# EAGLE design pcb_bare_tmc_2209 (EAGLE 9.6.2)

## Sheet 1 of 4: ESP32
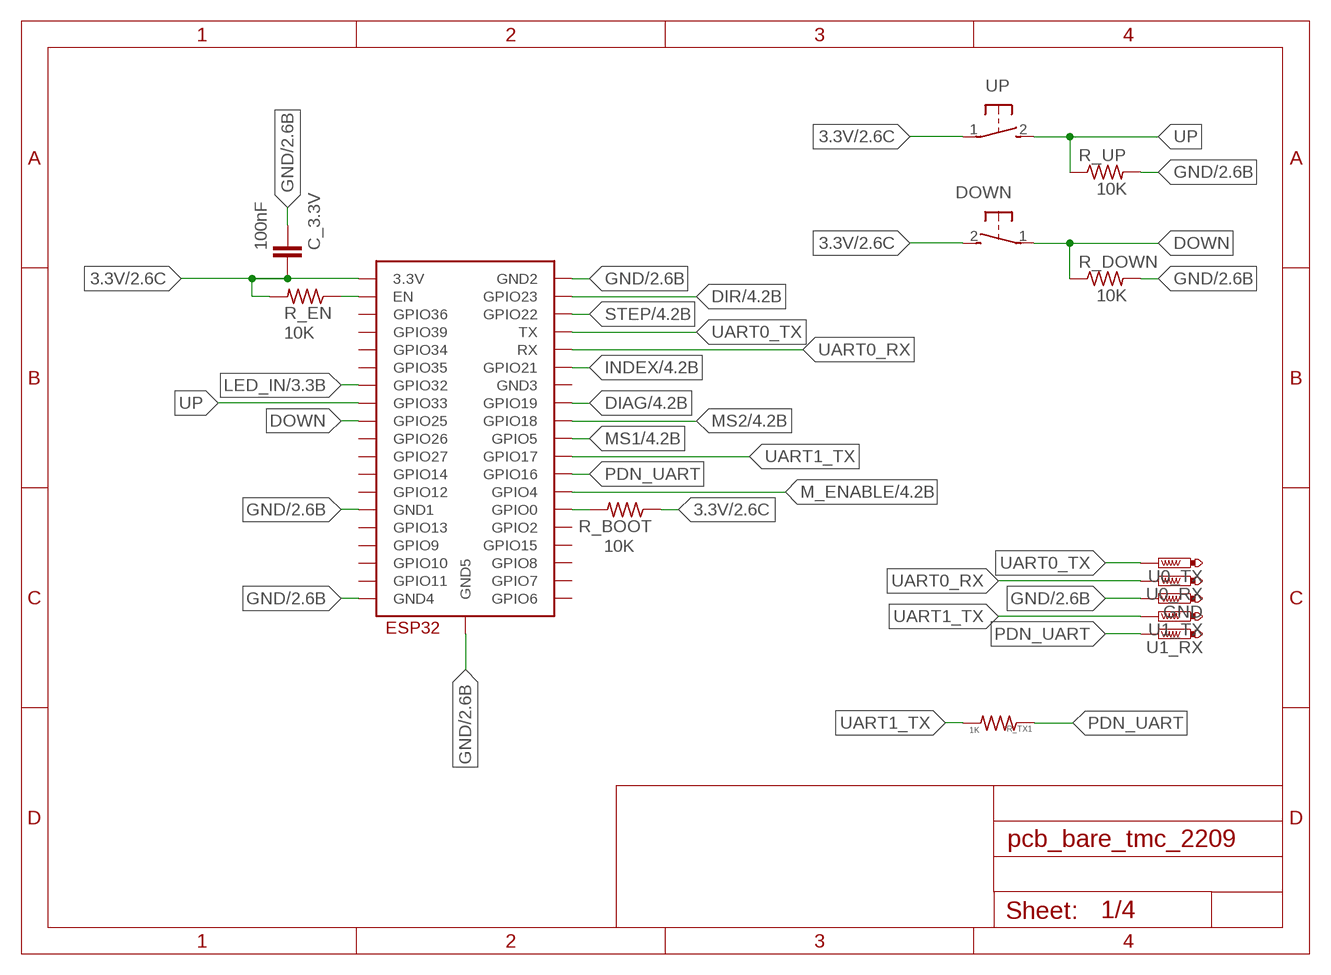
[diagram p0: schematic, sheet 1]

### Parts
C_3.3V  100nF  C-EUC0805K  [C0805K]
DOWN  31-XX  [B3F-31XX]
GND  PTR1TP20SQ  [TP20SQ]
R_BOOT  10K  R-US_R0805  [R0805]
R_DOWN  10K  R-US_R0805  [R0805]
R_EN  10K  R-US_R0805  [R0805]
R_TX1  1K  R-US_R0805  [R0805]
R_UP  10K  R-US_R0805  [R0805]
U0_RX  PTR1TP20SQ  [TP20SQ]
U0_TX  PTR1TP20SQ  [TP20SQ]
U1_RX  PTR1TP20SQ  [TP20SQ]
U1_TX  PTR1TP20SQ  [TP20SQ]
U$2  ESP32-WROOM  [ESP32-WROOM]
UP  31-XX  [B3F-31XX]

### Nets
3.3V: C_3.3V.2 DOWN.2(S) R_BOOT.1 R_EN.2 U$2.3V3(3.3V) UP.1(P) ; also sheet 2
DIAG: U$2.IO19(GPIO19) ; also sheet 4
DIR: U$2.IO23(GPIO23) ; also sheet 4
DOWN: DOWN.1(P) R_DOWN.1 U$2.IO25(GPIO25)
GND: C_3.3V.1 GND.TP R_DOWN.2 R_UP.2 U$2.GND1 U$2.GND2 U$2.GND4 U$2.GND5 ; also sheet 2,3,4
INDEX: U$2.IO21(GPIO21) ; also sheet 4
LED_IN: U$2.IO32(GPIO32) ; also sheet 3
M_ENABLE: U$2.IO4(GPIO4) ; also sheet 4
MS1: U$2.IO5(GPIO5) ; also sheet 4
MS2: U$2.IO18(GPIO18) ; also sheet 4
N$3: R_BOOT.2 U$2.IO0(GPIO0)
N$10: R_EN.1 U$2.EN
PDN_UART: R_TX1.1 U1_RX.TP U$2.IO16(GPIO16) ; also sheet 4
STEP: U$2.IO22(GPIO22) ; also sheet 4
UART0_RX: U0_RX.TP U$2.RX
UART0_TX: U0_TX.TP U$2.TX
UART1_TX: R_TX1.2 U1_TX.TP U$2.IO17(GPIO17)
UP: R_UP.1 U$2.IO33(GPIO33) UP.2(S)
Unconnected: U$2.CLK(GPIO6) U$2.CMD(GPIO11) U$2.GND3 U$2.IO2(GPIO2) U$2.IO12(GPIO12) U$2.IO13(GPIO13) U$2.IO14(GPIO14) U$2.IO15(GPIO15) U$2.IO26(GPIO26) U$2.IO27(GPIO27) U$2.IO34(GPIO34) U$2.IO35(GPIO35) U$2.SD0(GPIO7) U$2.SD1(GPIO8) U$2.SD2(GPIO9) U$2.SD3(GPIO10) U$2.SENSOR_VN(GPIO39) U$2.SENSOR_VP(GPIO36)

## Sheet 2 of 4: Power Supply
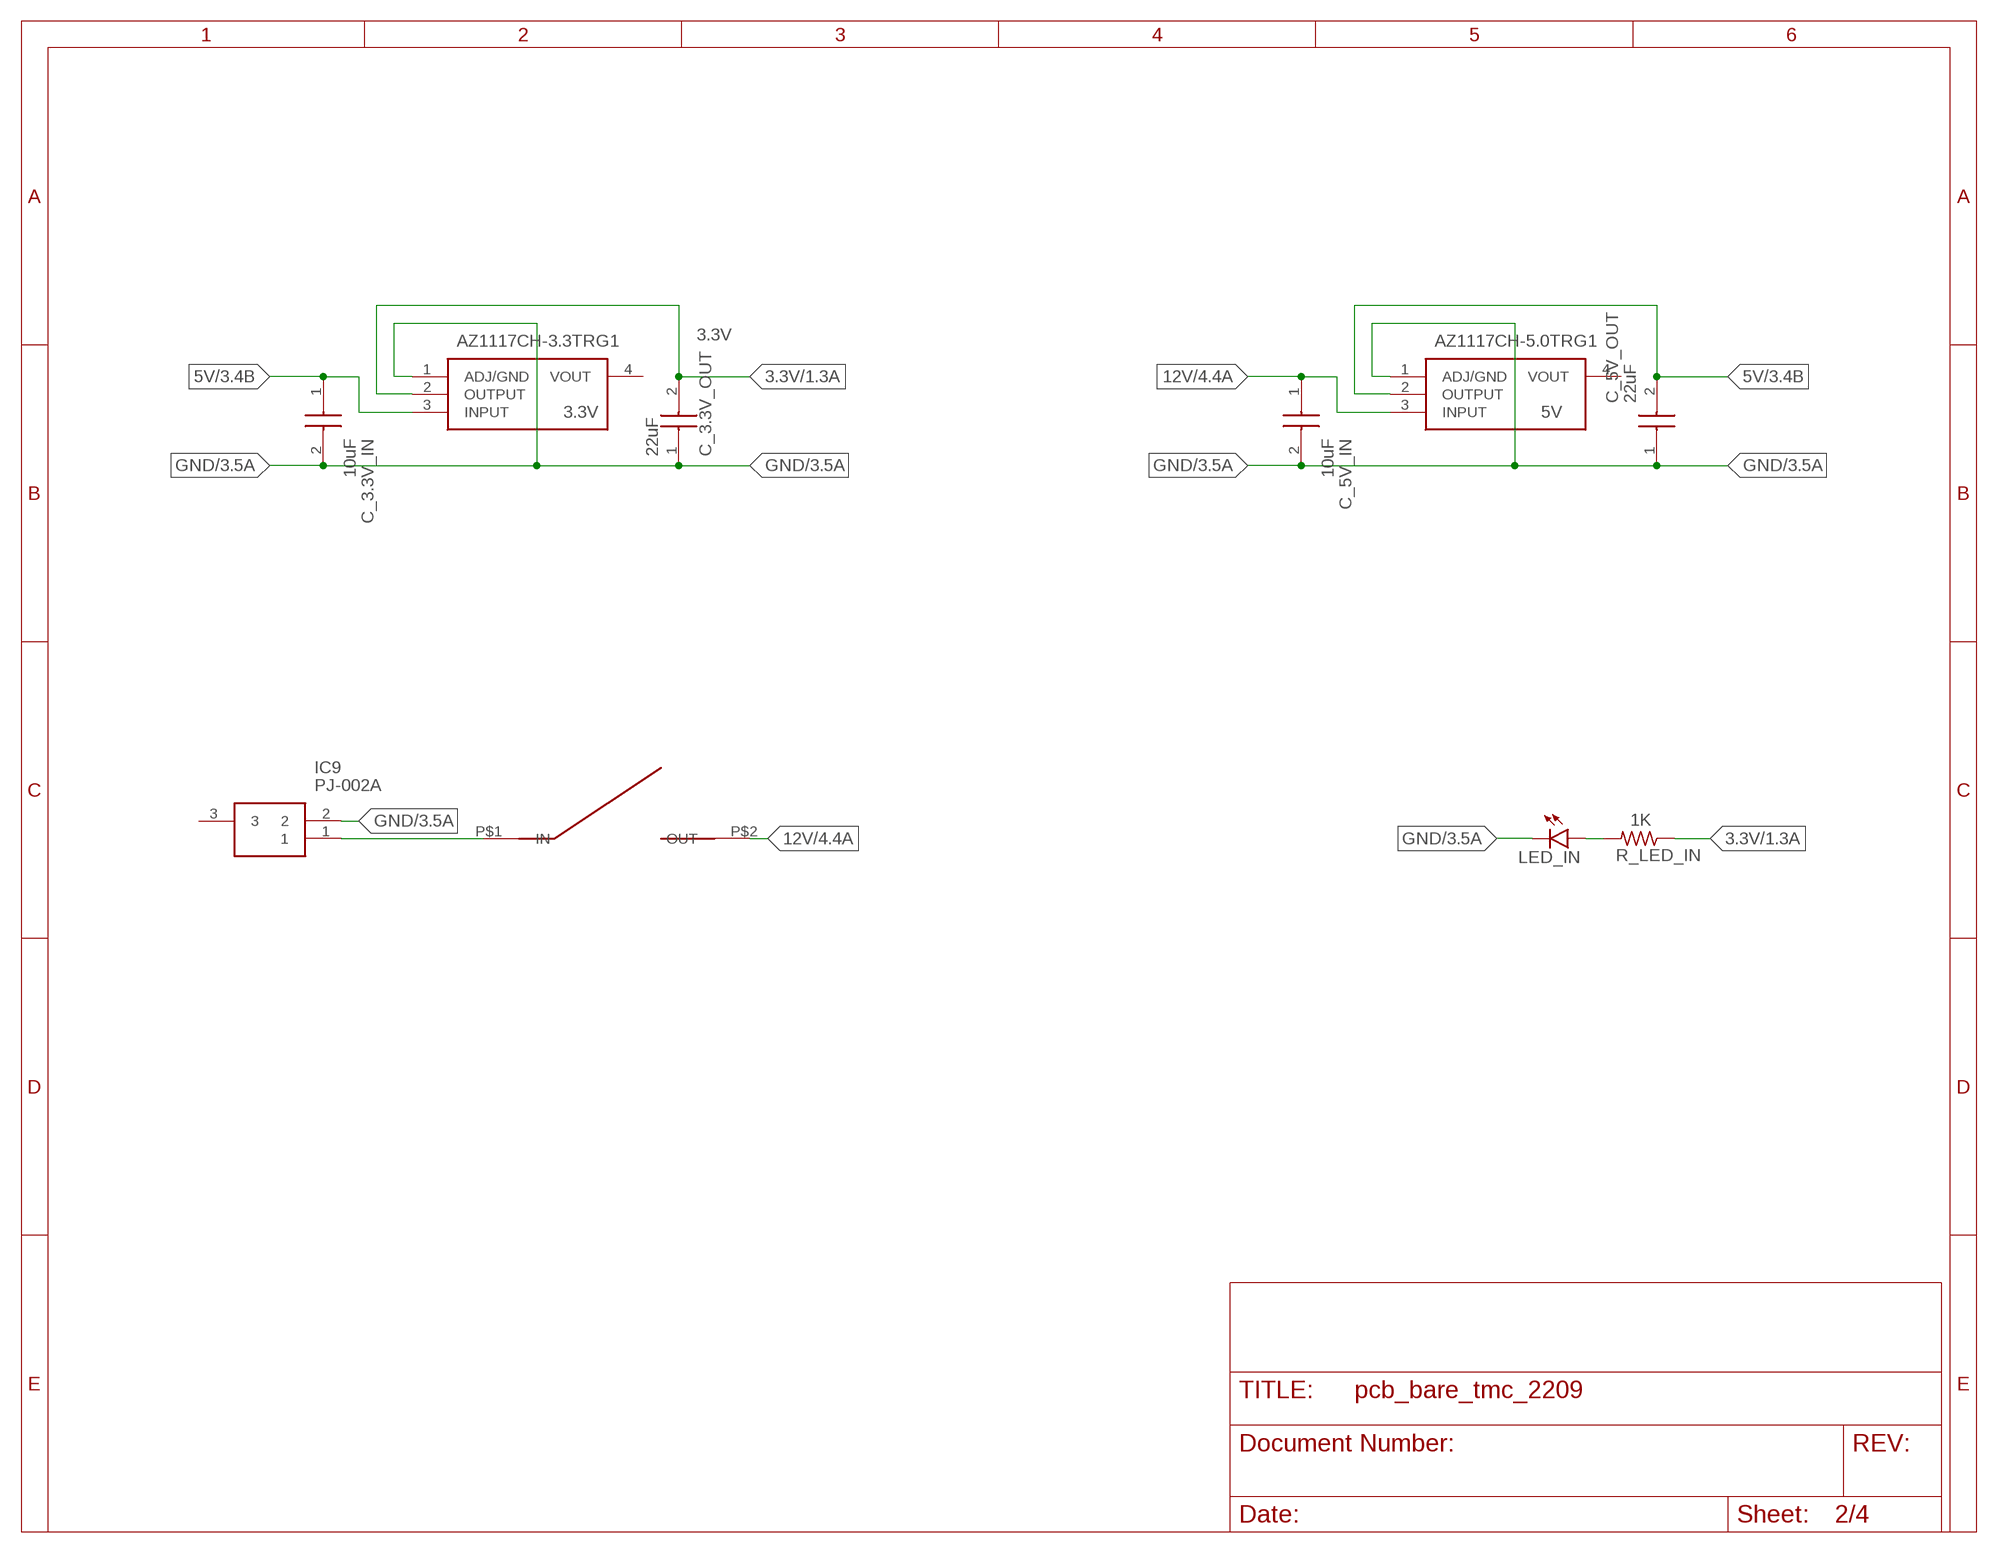
[diagram p1: schematic, sheet 2]

### Parts
3.3V  AZ1117CH-3.3TRG1  [SOT230P700X180-4N]
5V  AZ1117CH-5.0TRG1  [SOT230P700X180-4N]
C_3.3V_IN  10uF  EMK212ABJ106KD-T  [CAPC2013X95N]
C_3.3V_OUT  22uF  CL31A226MOCLNNC  [CAPC3216X100N]
C_5V_IN  10uF  EMK212ABJ106KD-T  [CAPC2013X95N]
C_5V_OUT  22uF  CL31A226MOCLNNC  [CAPC3216X100N]
IC9  PJ-002A  [PJ002A]
LED_IN  LEDSML0805  [SML0805]
R_LED_IN  1K  R-US_R0805  [R0805]
U$1  SPSTROCKERSWITCH2PIN  [SPST2PINROCKER]

### Nets
3.3V: 3.3V.2(OUTPUT) C_3.3V_OUT.2 R_LED_IN.1 ; also sheet 1
5V: 3.3V.3(INPUT) 5V.2(OUTPUT) C_3.3V_IN.1 C_5V_OUT.2 ; also sheet 3,4
12V: 5V.3(INPUT) C_5V_IN.1 U$1.P$2(OUT) ; also sheet 4
GND: 3.3V.1(ADJ/GND) 5V.1(ADJ/GND) C_3.3V_IN.2 C_3.3V_OUT.1 C_5V_IN.2 C_5V_OUT.1 IC9.2 LED_IN.C ; also sheet 1,3,4
N$1: IC9.1 U$1.P$1(IN)
N$2: LED_IN.A R_LED_IN.2
Unconnected: 3.3V.4(VOUT) 5V.4(VOUT) IC9.3

## Sheet 3 of 4: LED/LEVELSHIFTER
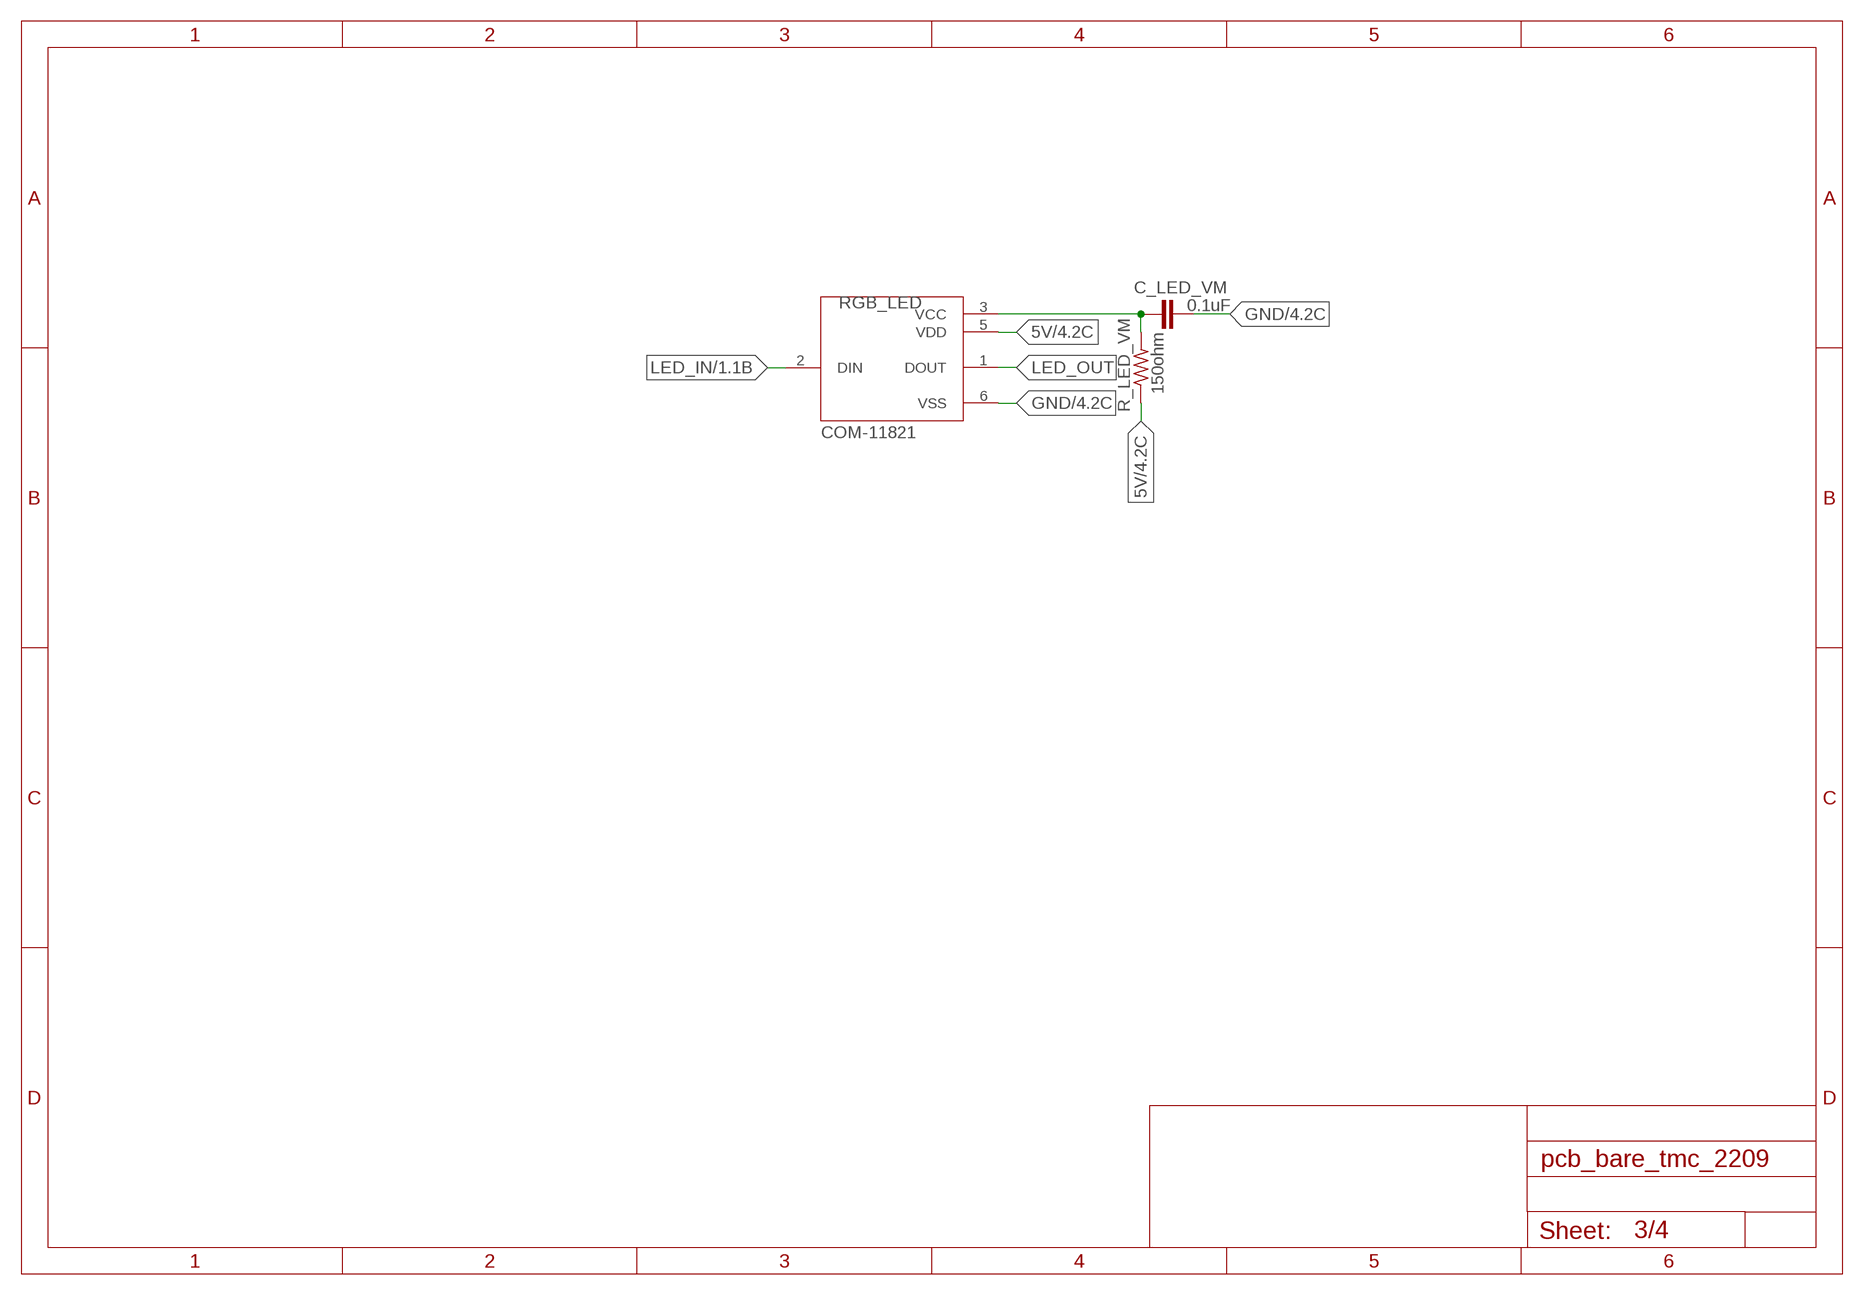
[diagram p2: schematic, sheet 3]

### Parts
C_LED_VM  0.1uF  C-EUC0805K  [C0805K]
R_LED_VM  150ohm  R-US_R0805  [R0805]
RGB_LED  COM-11821  [LED_COM-11821]

### Nets
5V: R_LED_VM.1 RGB_LED.5(VDD) ; also sheet 2,4
GND: C_LED_VM.2 RGB_LED.6(VSS) ; also sheet 1,2,4
LED_IN: RGB_LED.2(DIN) ; also sheet 1
LED_OUT: RGB_LED.1(DOUT)
N$77: C_LED_VM.1 R_LED_VM.2 RGB_LED.3(VCC)

## Sheet 4 of 4
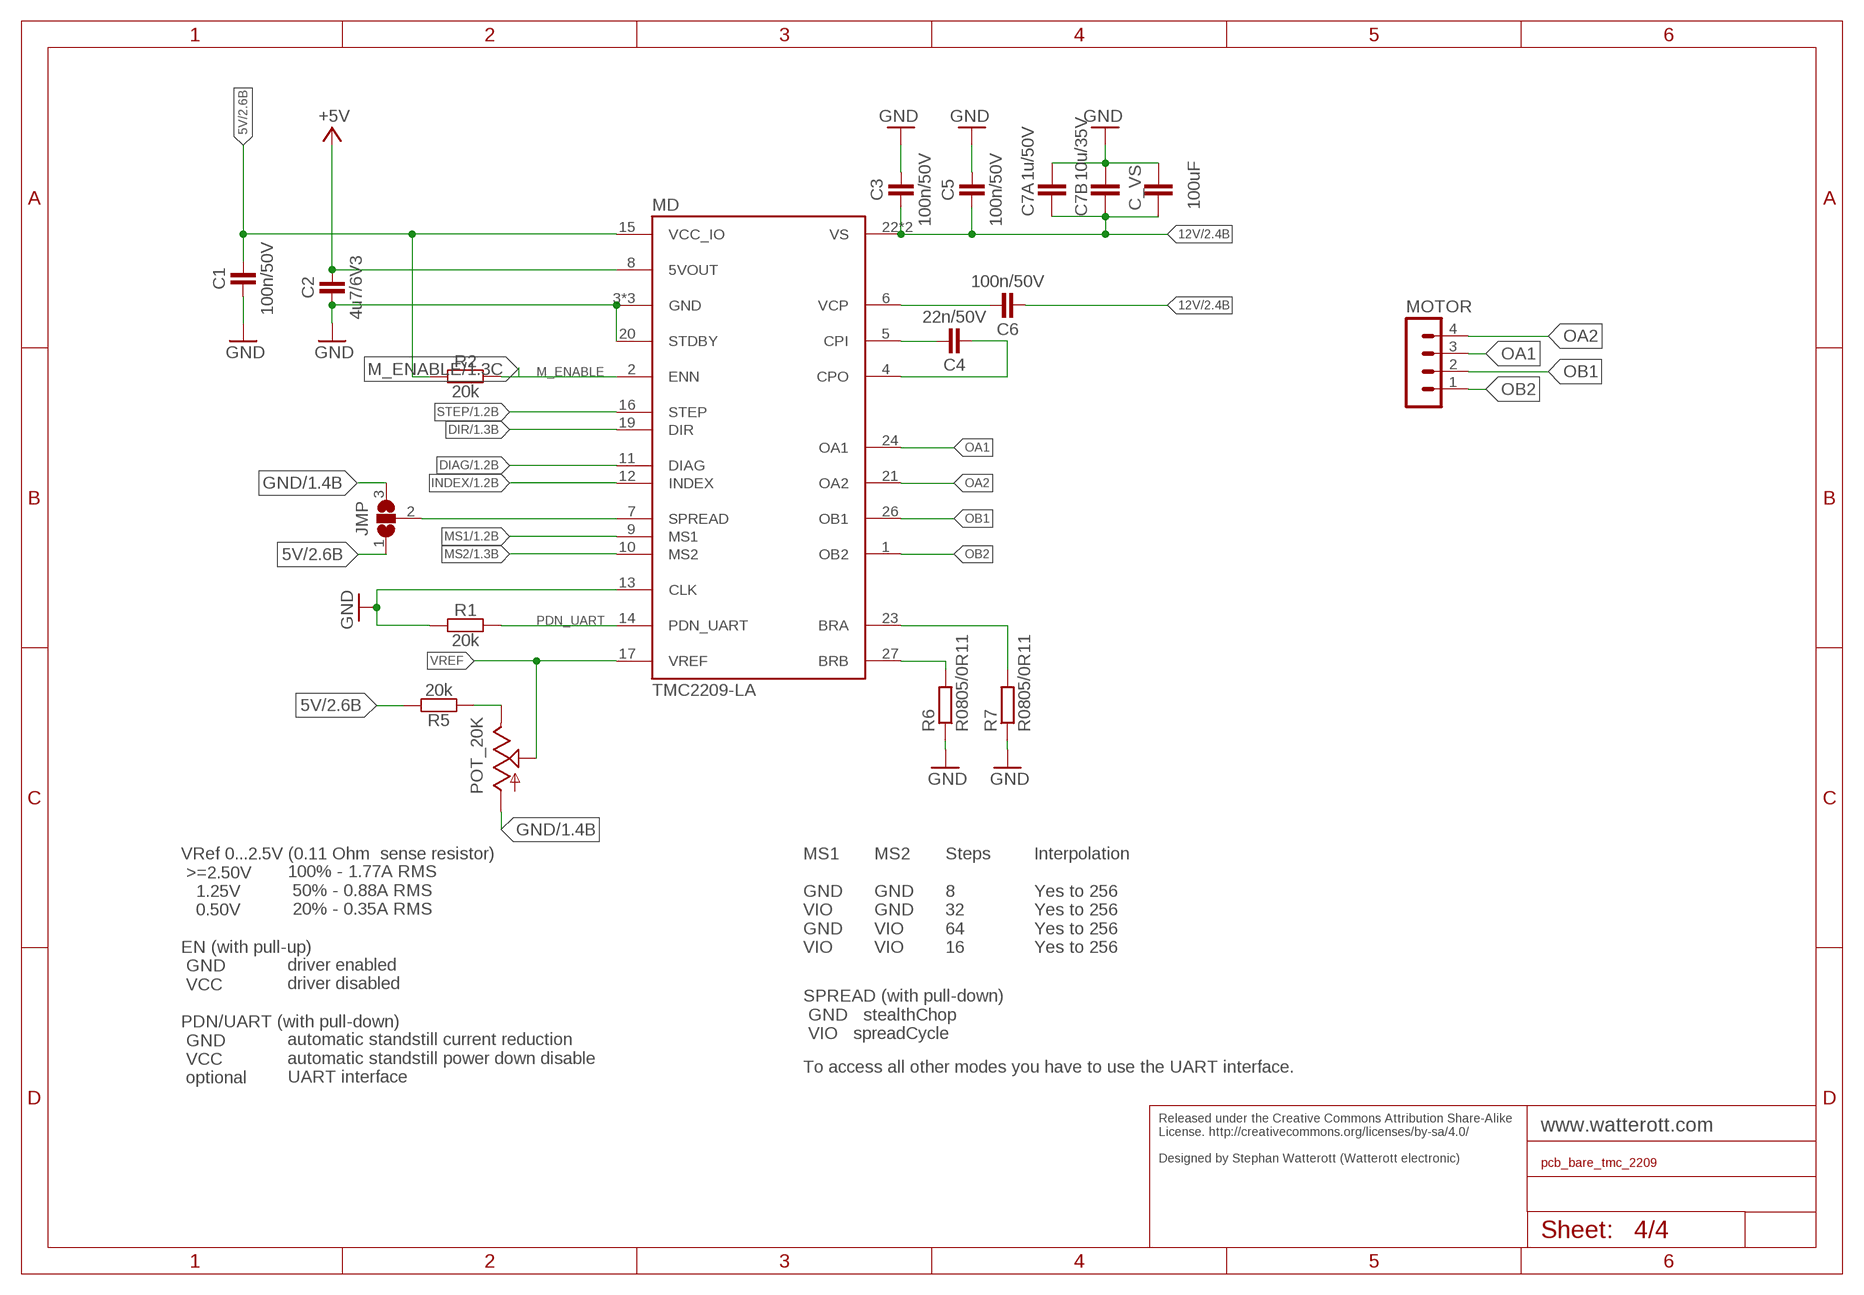
[diagram p3: schematic, sheet 4]

### Parts
C1  100n/50V  CAPACITOR-0402  [C0402]
C2  4u7/6V3  CAPACITOR-0402  [C0402]
C3  100n/50V  CAPACITOR-0402  [C0402]
C4  22n/50V  CAPACITOR-0402  [C0402]
C5  100n/50V  CAPACITOR-0402  [C0402]
C6  100n/50V  CAPACITOR-0402  [C0402]
C7A  1u/50V  C-EUC0805  [C0805]
C7B  10u/35V  C-EUC1206  [C1206]
C_VS  100uF  C2,5-3  [C2.5-3]
JMP  JUMPER3-0402-NC  [JUMPER3-0402_NC]
MD  TMC2209-LA  [QFN28-PAD3.7]
MOTOR  MA04-1  [MA04-1]
POT_20K  TRIM_US-3223G  [3223G]
R1  20k  RESISTOR-0402  [C0402]
R2  20k  RESISTOR-0402  [C0402]
R5  20k  RESISTOR-0402  [C0402]
R6  R0805/0R11  R-EU_M0805  [M0805]
R7  R0805/0R11  R-EU_M0805  [M0805]

### Nets
5V: C1.2 JMP.1 MD.15(VCC_IO) R2.1 R5.2 ; also sheet 2,3
12V: C3.1 C5.1 C6.1 C7A.1 C7B.1 C_VS.1 MD.22(VS) MD.28(VS) ; also sheet 2
+5V: C2.2 MD.8(5VOUT)
BRA: MD.23(BRA) R7.2
BRB: MD.27(BRB) R6.2
CPI: C4.2 MD.5(CPI)
CPO: C4.1 MD.4(CPO)
DIAG: MD.11(DIAG) ; also sheet 1
DIR: MD.19(DIR) ; also sheet 1
GND: C1.1 C2.1 C3.2 C5.2 C7A.2 C7B.2 C_VS.2 JMP.3 MD.3(GND) MD.13(CLK) MD.18(GND) MD.20(STDBY) MD.TP(GND) POT_20K.1(A) R1.1 R6.1 R7.1 ; also sheet 1,2,3
INDEX: MD.12(INDEX) ; also sheet 1
M_ENABLE: MD.2(ENN) R2.2 ; also sheet 1
MS1: MD.9(MS1) ; also sheet 1
MS2: MD.10(MS2) ; also sheet 1
N$4: JMP.2 MD.7(SPREAD)
OA1: MD.24(OA1) MOTOR.3
OA2: MD.21(OA2) MOTOR.4
OB1: MD.26(OB1) MOTOR.2
OB2: MD.1(OB2) MOTOR.1
PDN_UART: MD.14(PDN_UART) R1.2 ; also sheet 1
STEP: MD.16(STEP) ; also sheet 1
VCP: C6.2 MD.6(VCP)
VREF: MD.17(VREF) POT_20K.2(S)
VREF1: POT_20K.3(E) R5.1

### Notes on the sheet
- VRef 0...2.5V (0.11 Ohm  sense resistor)
   >=2.50V
     1.25V
     0.50V
  
  EN (with pull-up)
   GND
   VCC
  
  PDN/UART (with pull-down)
   GND
   VCC
   optional
- MS1
  
  GND
  VIO
  GND
  VIO
- MS2
  
  GND
  GND
  VIO
  VIO
- Steps
  
  8
  32
  64
  16
- Interpolation
  
  Yes to 256
  Yes to 256
  Yes to 256
  Yes to 256
- 100% - 1.77A RMS
   50% - 0.88A RMS
   20% - 0.35A RMS
  
  
  driver enabled
  driver disabled
  
  
  automatic standstill current reduction
  automatic standstill power down disable
  UART interface
- SPREAD (with pull-down)
   GND   stealthChop
   VIO   spreadCycle
- To access all other modes you have to use the UART interface.
- Released under the Creative Commons Attribution Share-Alike 
  License. http://creativecommons.org/licenses/by-sa/4.0/
  
  Designed by Stephan Watterott (Watterott electronic)

## Library data of the parts
3.3V = SamacSys_Parts:AZ1117CH-3.3TRG1: 1.35A 3.3V LDO Reg. Current Limit SOT223 DiodesZetex AZ1117CH-3.3TRG1, LDO Voltage Regulator, 0.8A, 3.3 V +/-1%, maximum of 15 Vin, 3-Pin SOT-223 Source: Datasheet <https://datasheet.datasheetarchive.com/originals/distributors/Datasheets-DGA25/1776204.pdf>; DESCRIPTION: 1.35A 3.3V LDO Reg. Current Limit SOT223 DiodesZetex AZ1117CH-3.3TRG1, LDO Voltage Regulator, 0.8A, 3.3 V +/-1%, maximum of 15 Vin, 3-Pin SOT-223; HEIGHT: 1.8mm; MANUFACTURER_NAME: Diodes Inc.; MANUFACTURER_PART_NUMBER: AZ1117CH-3.3TRG1; MOUSER_PART_NUMBER: 621-AZ1117CH-3.3TRG1; MOUSER_PRICE-STOCK: https://www.mouser.co.uk/ProductDetail/Diodes-Incorporated/AZ1117CH-33TRG1?qs=FKu9oBikfSm7ntaG6olPSQ%3D%3D
5V = SamacSys_Parts:AZ1117CH-5.0TRG1: DiodesZetex AZ1117CH-5.0TRG1, LDO Regulator, 300mA, 5 V, +/-1% 3+Tab-Pin, SOT-223 Source: Datasheet <https://www.diodes.com/assets/Datasheets/AZ1117C.pdf>; DESCRIPTION: DiodesZetex AZ1117CH-5.0TRG1, LDO Regulator, 300mA, 5 V, +/-1% 3+Tab-Pin, SOT-223; HEIGHT: 1.8mm; MANUFACTURER_NAME: Diodes Inc.; MANUFACTURER_PART_NUMBER: AZ1117CH-5.0TRG1; MOUSER_PART_NUMBER: 621-AZ1117CH-5.0TRG1; MOUSER_PRICE-STOCK: https://www.mouser.co.uk/ProductDetail/Diodes-Incorporated/AZ1117CH-50TRG1?qs=FKu9oBikfSlJYUAtiuMgOw%3D%3D
C1-C6 = we-rcl:CAPACITOR: Capacitor ...2.2uF @ 6.3V -> 0402 ...4.7uF @ 6.3V -> 0603 ...10uF @ 16V -> 0805 ...22uF @ 25V -> 1206
C7A C7B = rcl:C-EU: CAPACITOR, European symbol
C_3.3V C_LED_VM = rcl:C-EU: CAPACITOR, European symbol; SPICEPREFIX: C
C_3.3V_IN C_5V_IN = SamacSys_Parts:EMK212ABJ106KD-T: Taiyo Yuden 0805 (2012M) 10uF Multilayer Ceramic Capacitor MLCC 16V dc +/-10% SMD EMK212ABJ106KD-T Source: Datasheet <https://ds.yuden.co.jp/TYCOMPAS/ut/detail?pn=EMK212ABJ106KD-T &u=M>; DESCRIPTION: Taiyo Yuden 0805 (2012M) 10uF Multilayer Ceramic Capacitor MLCC 16V dc +/-10% SMD EMK212ABJ106KD-T; HEIGHT: 0.95mm; MANUFACTURER_NAME: TAIYO YUDEN; MANUFACTURER_PART_NUMBER: EMK212ABJ106KD-T; MOUSER_PART_NUMBER: 963-EMK212ABJ106KD-T; MOUSER_PRICE-STOCK: https://www.mouser.co.uk/ProductDetail/Taiyo-Yuden/EMK212ABJ106KD-T?qs=I6KAKw0tg2yYKujEsK8opA%3D%3D
C_3.3V_OUT C_5V_OUT = SamacSys_Parts:CL31A226MOCLNNC: Ceramic capacitor 1206 X5R 16V 22uF Samsung Electro-Mechanics 1206 CL 22uF Ceramic Multilayer Capacitor, 16 V, +85C, X5R Dielectric, +/-20% SMD Source: Datasheet <https://datasheet.datasheetarchive.com/originals/distributors/Datasheets_SAMA/f725fe7da06092c10c109ee50d712988.pdf>; DESCRIPTION: Ceramic capacitor 1206 X5R 16V 22uF Samsung Electro-Mechanics 1206 CL 22uF Ceramic Multilayer Capacitor, 16 V, +85C, X5R Dielectric, +/-20% SMD; HEIGHT: 1mm; MANUFACTURER_NAME: Samsung Electro-Mechanics; MANUFACTURER_PART_NUMBER: CL31A226MOCLNNC; MOUSER_PART_NUMBER: 187-CL31A226MOCLNNC; MOUSER_PRICE-STOCK: https://www.mouser.co.uk/ProductDetail/Samsung-Electro-Mechanics/CL31A226MOCLNNC?qs=X6jEic%2FHinD7wddQJyY%252BZw%3D%3D
C_VS = capacitor-wima:C: CAPACITOR naming: grid - package width
DOWN UP = switch-omron:31-XX: OMRON SWITCH; MPN: B3F-3100; OC_FARNELL: 959704; OC_NEWARK: 36M3582
GND U0_RX U0_TX U1_RX U1_TX = testpad:PTR1: TEST PIN
IC9 = SamacSys_Parts:PJ-002A: CONN PWR JACK 2X5.5MM SOLDER Source: Datasheet <https://www.cui.com/product/resource/digikeypdf/pj-002a.pdf>; DESCRIPTION: CONN PWR JACK 2X5.5MM SOLDER; HEIGHT: 11mm; MANUFACTURER_NAME: CUI Inc.; MANUFACTURER_PART_NUMBER: PJ-002A; MOUSER_PART_NUMBER: 490-PJ-002A; MOUSER_PRICE-STOCK: https://www.mouser.co.uk/ProductDetail/CUI-Devices/PJ-002A?qs=WyjlAZoYn51CKfAix9Mngw%3D%3D
JMP = we-rcl:JUMPER3: 3-Pin Jumper
LED_IN = led:LED: LED OSRAM: - CHIPLED LG R971, LG N971, LY N971, LG Q971, LY Q971, LO R971, LY R971 LH N974, LH R974 LS Q976, LO Q976, LY Q976 LO Q996 - Hyper CHIPLED LW Q18S LB Q993, LB Q99A, LB R99A - SideLED LS A670, LO A670, LY A670, LG A670, LP A670 LB A673, LV A673, LT A673, LW A673 LH A674 LY A675 LS A676, LA A676, LO A676, LY A676, LW A676 LS A679, LY A679, LG A679 - Hyper Micro SIDELED® LS Y876, LA Y876, LO Y876, LY Y876 LT Y87S - SmartLED LW L88C, LW L88S LB L89C, LB L89S, LG L890 LS L89K, LO L89K, LY L89K LS L896, LA L896, LO L896, LY L896 - TOPLED LS T670, LO T670, LY T670, LG T670, LP T670 LSG T670, LSP T670, LSY T670, LOP T670, LYG T670 LG T671, LOG T671, LSG T671 LB T673, LV T673, LT T673, LW T673 LH T674 LS T676, LA T676, LO T676, LY T676, LB T676, LH T676, LSB T676, LW T676 LB T67C, LV T67C, LT T67C, LS T67K, LO T67K, LY T67K, LW E67C LS E67B, LA E67B, LO E67B, LY E67B, LB E67C, LV E67C, LT E67C LW T67C LS T679, LY T679, LG T679 LS T770, LO T770, LY T770, LG T770, LP T770 LB T773, LV T773, LT T773, LW T773 LH T774 LS E675, LA E675, LY E675, LS T675 LS T776, LA T776, LO T776, LY T776, LB T776 LHGB T686 LT T68C, LB T68C - Hyper Mini TOPLED® LB M676 - Mini TOPLED Santana® LG M470 LS M47K, LO M47K, LY M47K Source: http://www.osram.convergy.de LUXEON: - LUMILED® LXK2-PW12-R00, LXK2-PW12-S00, LXK2-PW14-U00, LXK2-PW14-V00 LXK2-PM12-R00, LXK2-PM12-S00, LXK2-PM14-U00 LXK2-PE12-Q00, LXK2-PE12-R00, LXK2-PE12-S00, LXK2-PE14-T00, LXK2-PE14-U00 LXK2-PB12-K00, LXK2-PB12-L00, LXK2-PB12-M00, LXK2-PB14-N00, LXK2-PB14-P00, LXK2-PB14-Q00 LXK2-PR12-L00, LXK2-PR12-M00, LXK2-PR14-Q00, LXK2-PR14-R00 LXK2-PD12-Q00, LXK2-PD12-R00, LXK2-PD12-S00 LXK2-PH12-R00, LXK2-PH12-S00 LXK2-PL12-P00, LXK2-PL12-Q00, LXK2-PL12-R00 Source: www.luxeon.com KINGBRIGHT: KA-3528ASYC Source: www.kingbright.com
MD = we-chip:TMC2209: Trinamic TMC2209 Stepper Motor Driver (5V...28V, 1.8A RMS, 256 microsteps)
MOTOR = con-lstb:MA04-1: PIN HEADER; OC_FARNELL: unknown; OC_NEWARK: unknown
POT_20K = pot:TRIM_US-: POTENTIOMETER
R1 R2 R5 = we-rcl:RESISTOR: Resistor all kinds in 0402 and 0603
R6 R7 = rcl:R-EU_: RESISTOR, European symbol
R_BOOT R_DOWN R_EN R_LED_IN R_LED_VM R_TX1 R_UP = rcl:R-US_: RESISTOR, American symbol; SPICEPREFIX: R
RGB_LED = COM-11821:COM-11821: Led - Smd Rgb (Ws2812) Check prices <https://pricing.snapeda.com/parts/COM-11821/SparkFun%20Electronics/view-part?ref=eda>; AVAILABILITY: In Stock; DESCRIPTION: Addressable Lighting series 1 LED Discrete Serial (Shift Register) Red, Green, Blue (RGB) 5.00mm L x 5.00mm W; MF: SparkFun Electronics; MP: COM-11821; PACKAGE: DIP-18 SparkFun Electronics; PRICE: None; PURCHASE-URL: https://pricing.snapeda.com/search/part/COM-11821/?ref=eda
U$1 = spstrocker2pin:SPSTROCKERSWITCH2PIN
U$2 = ESP32_v2:ESP32-WROOM

## Board
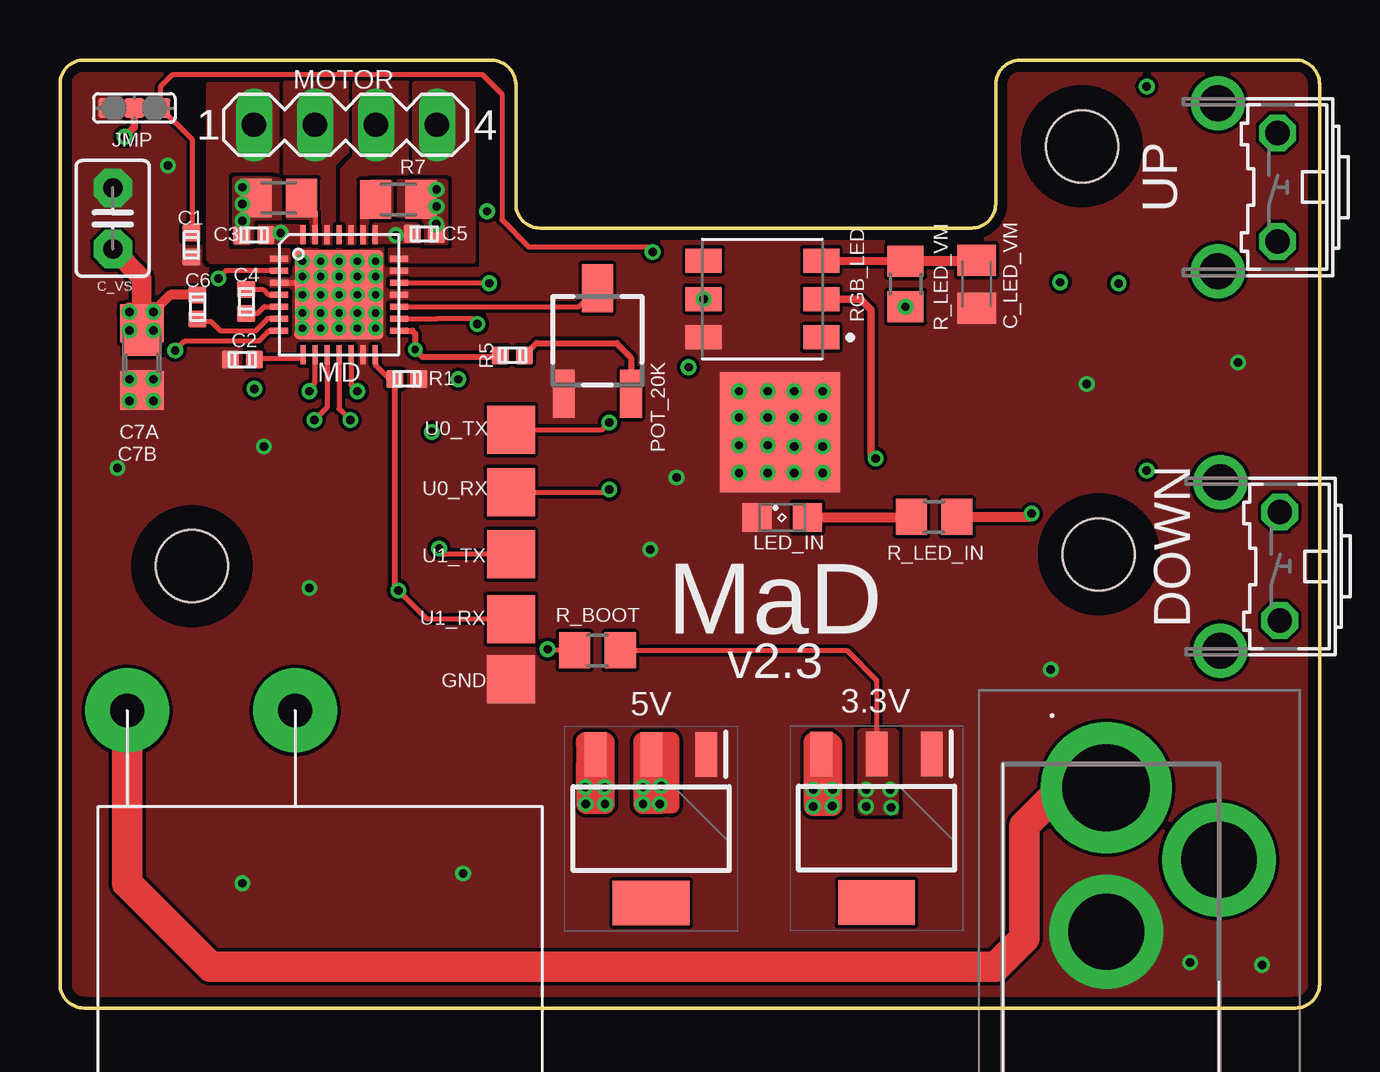
[diagram p4: board, top side]
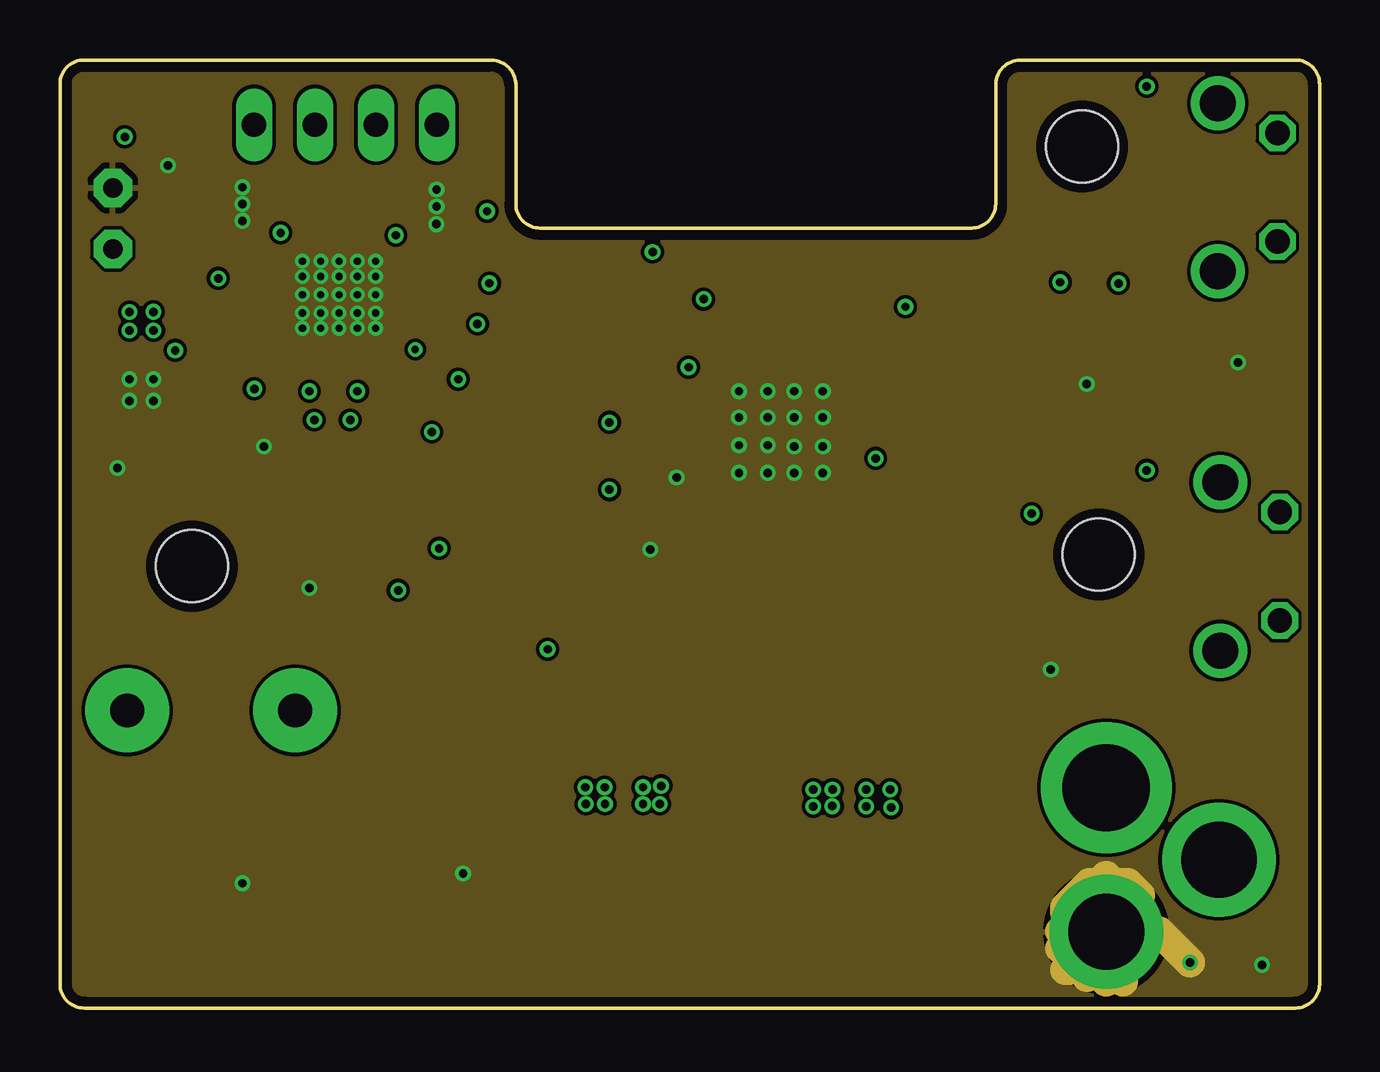
[diagram p5: board, inner layer GND]
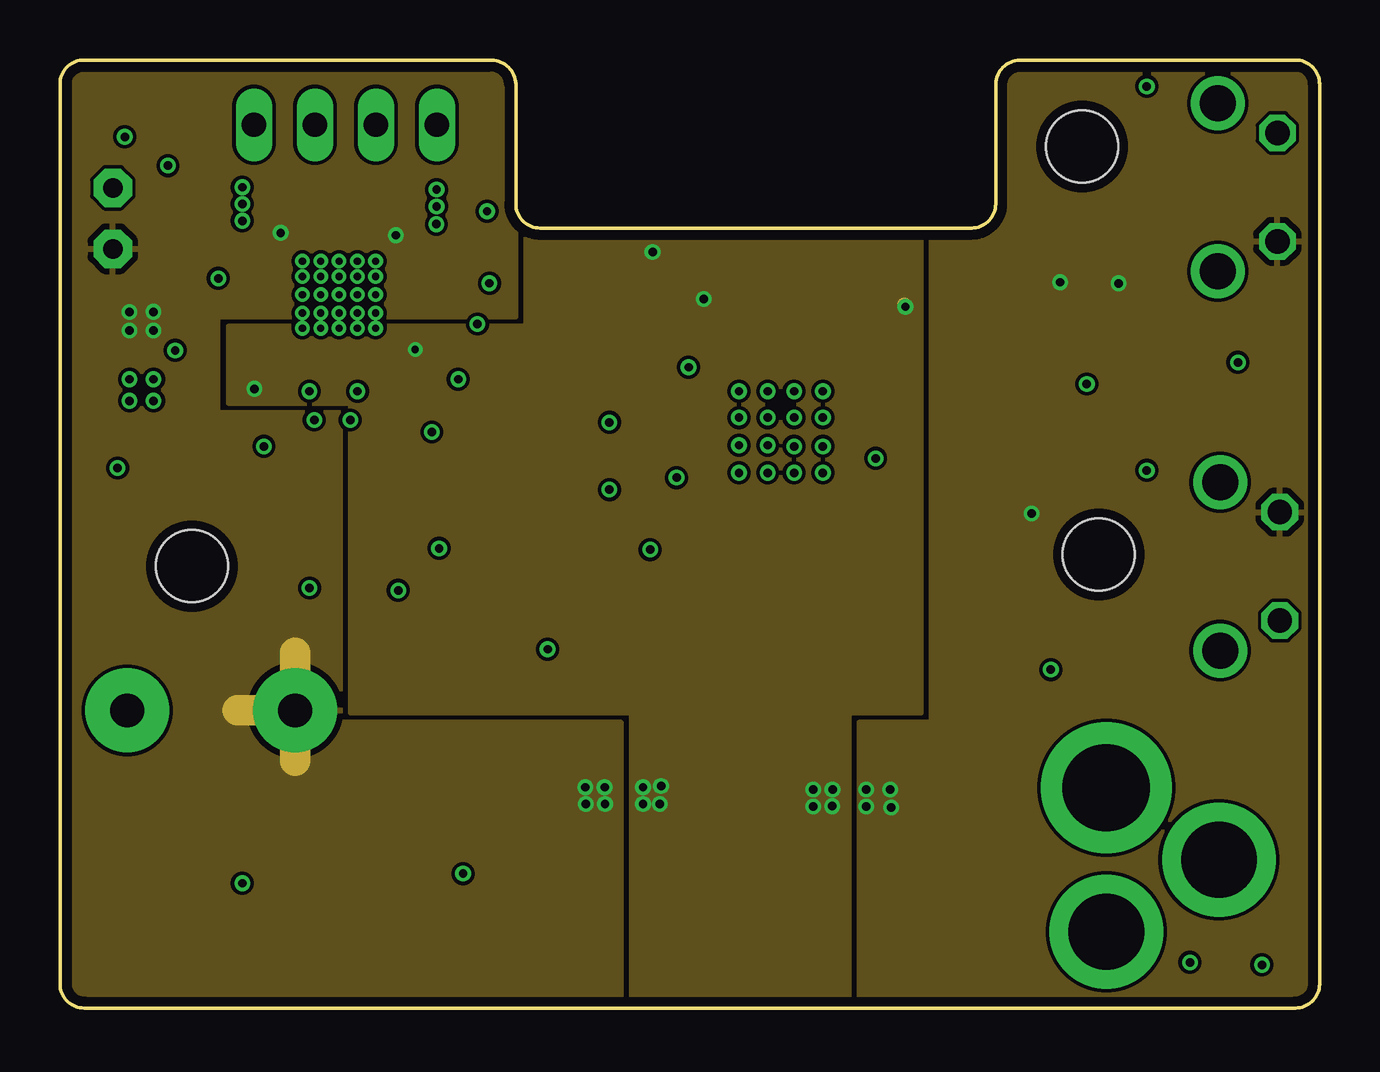
[diagram p6: board, inner layer Supply]
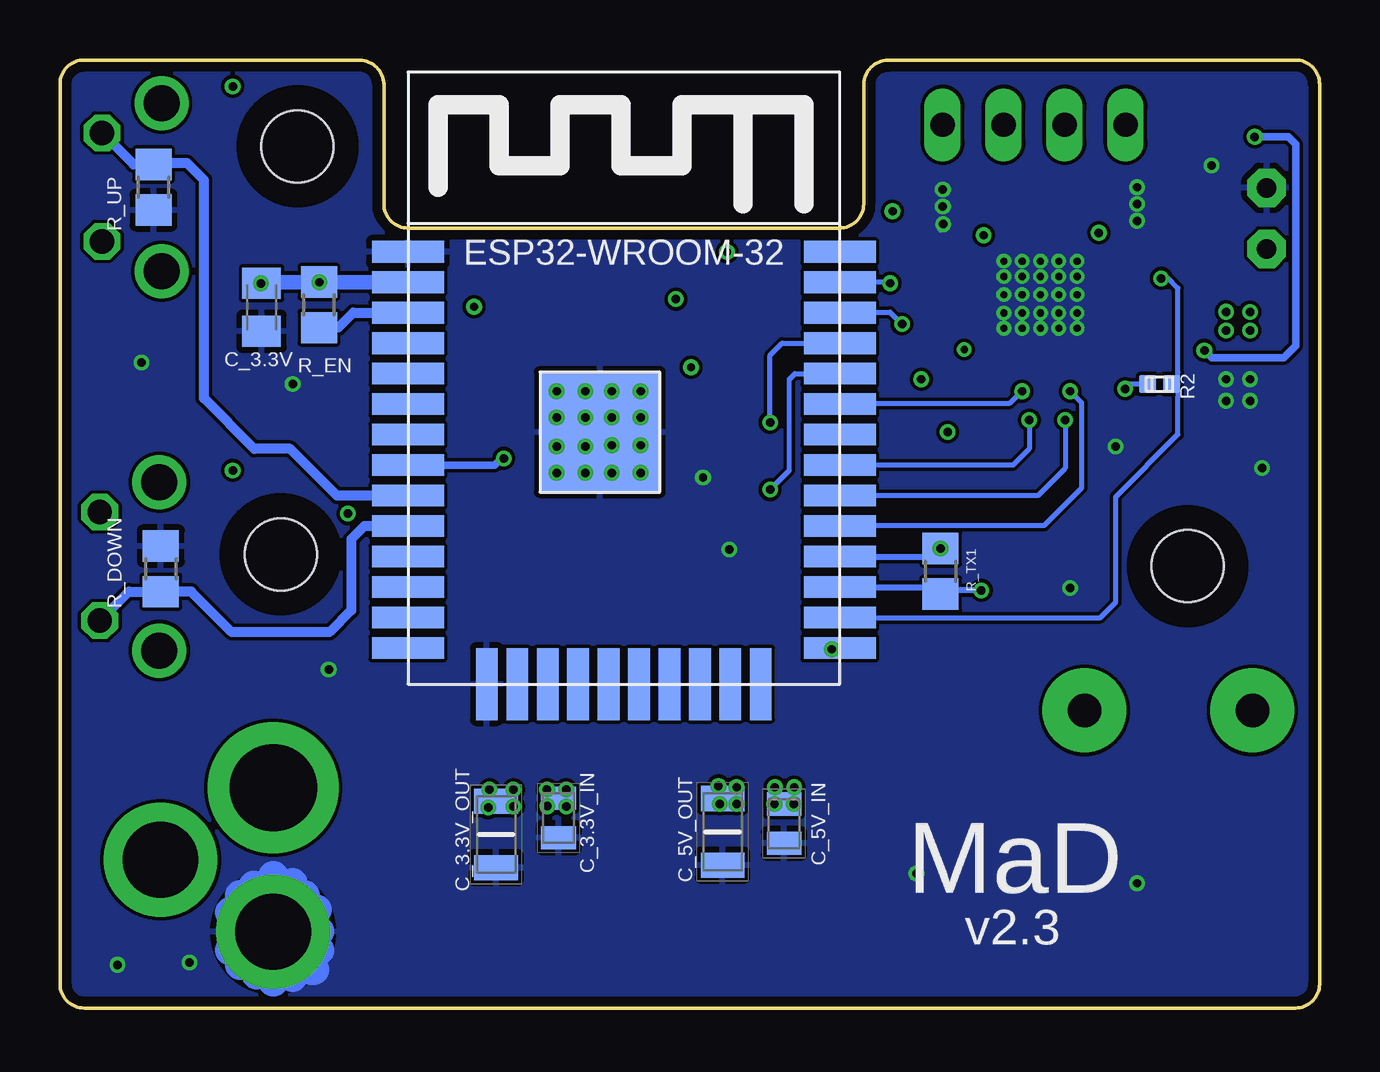
[diagram p7: board, bottom side, seen from below]

Size 52.5 x 39.5 mm. Coordinates in mm from the lower left corner, seen from the top.
Outline: 1,0 51.5,0 arc90 52.5,1 52.5,38.5 arc90 51.5,39.5 40.1,39.5 arc90 39,38.5 39,33.5 arc-90 38,32.5 20,32.5 arc-90 19,33.5 19,38.5 arc90 17.9,39.5 1,39.5 arc90 0,38.5 0,1 arc90 1,0
Copper layers (1+2*15+16): Top 0.035mm / dielectric 0.35mm / GND 0.035mm / dielectric 0.76mm / Supply 0.035mm / dielectric 0.35mm / Bottom 0.035mm
Design rules "default *": minimum track width 0.15mm, minimum drill 0.25mm, track to track 0.15mm, track to pad 0.15mm, pad to pad 0.15mm, via to via 0.15mm, smd to smd 0mil, copper to edge 0.4mm, drill to drill 8mil, minimum pad ring 10mil, minimum via ring 6mil, stop-mask expansion 2mil, vias tented up to drill 0.5mm, thermal gap 10mil
Holes 3 mm at 5.5,18.41 43.3,18.9 42.6,35.9
tRestrict: area 3,15.9 to 8,20.9; area 40.1,33.4 to 45.1,38.4; area 40.8,16.4 to 45.8,21.4
bRestrict: area 3,15.9 to 8,20.9; area 40.8,16.4 to 45.8,21.4; area 40.1,33.4 to 45.1,38.4

### Footprints (pad centres in the part's own frame; a part is rotated, then mirrored left to right if it is on the bottom)
SOT230P700X180-4N = smd 1.85 x 0.9: 1 -3.1,2.3; 2 -3.1,0; 3 -3.1,-2.3 | smd 1.85 x 3.2: 4 3.1,0
C0402 = smd 0.75 x 0.7: 1 0,0.5; 2 0,-0.5
C0805 = smd 1.3 x 1.5: 1 -0.95,0; 2 0.95,0
C1206 = smd 1.6 x 1.8: 1 -1.4,0; 2 1.4,0
C0805K = smd 1.3 x 1.6: 1 -1,0; 2 1,0
CAPC2013X95N = smd 0.96 x 1.44: 1 -0.82,0; 2 0.82,0
CAPC3216X100N = smd 1.05 x 1.82: 1 -1.39,0; 2 1.39,0
C2.5-3 = drill 0.813 pad 1.6 octagon: 1 -1.27,0; 2 1.27,0
B3F-31XX = drill 1.016 octagon: 1 -2.261,-1.245; 2 2.261,-1.245 | drill 1.499 pad 2.159: 3 -3.505,1.245; 4 3.505,1.245
TP20SQ = smd 2 x 2: TP 0,0
PJ002A = drill 3.64 pad 5.46: 1 0,0 | drill 3.16 pad 4.74: 2 -6,0; 3 -3,-4.7
JUMPER3-0402_NC = smd 0.8 x 0.8: 1 0,1.1; 2 0,0; 3 0,-1.1
SML0805 = smd 1.2 x 1.2: A 1.05,0; C -1.05,0
QFN28-PAD3.7 = smd 0.8 x 0.26: 1 -2.5,1.5; 2 -2.5,1; 3 -2.5,0.5; 4 -2.5,0; 5 -2.5,-0.5; 6 -2.5,-1; 7 -2.5,-1.5; 15 2.5,-1.5; 16 2.5,-1; 17 2.5,-0.5; 18 2.5,0; 19 2.5,0.5; 20 2.5,1; 21 2.5,1.5 | smd 0.26 x 0.8: 8 -1.5,-2.5; 9 -1,-2.5; 10 -0.5,-2.5; 11 0,-2.5; 12 0.5,-2.5; 13 1,-2.5; 14 1.5,-2.5; 22 1.5,2.5; 23 1,2.5; 24 0.5,2.5; 25 0,2.5; 26 -0.5,2.5; 27 -1,2.5; 28 -1.5,2.5 | smd 3.7 x 3.7: TP 0,0
MA04-1 = drill 1.016 long: 1 -3.81,0; 2 -1.27,0; 3 1.27,0; 4 3.81,0
3223G = smd 2 x 0.9: 1 -2.2,1.4; 3 -2.2,-1.4 | smd 2 x 1.3: 2 2.2,0
M0805 = smd 1.3 x 1.6: 1 -0.95,0; 2 0.95,0
R0805 = smd 1.3 x 1.5: 1 -0.95,0; 2 0.95,0
LED_COM-11821 = smd 1.5 x 1: 1 -2.45,1.6; 2 -2.45,0; 3 -2.45,-1.6; 4 2.45,-1.6; 5 2.45,0; 6 2.45,1.6
SPST2PINROCKER = drill 1.4 pad 3.5: P$1 0,0; P$2 7,0
ESP32-WROOM = smd 3 x 0.9: 3V3 0,16.74; EN 0,15.47; GND1 0,18.01; GND3 18,18.01; IO0 18,1.5; IO4 18,2.77; IO5 18,6.58; IO12 0,1.5; IO14 0,2.77; IO16 18,4.04; IO17 18,5.31; IO18 18,7.85; IO19 18,9.12; IO21 18,11.66; IO22 18,15.47; IO23 18,16.74; IO25 0,6.58; IO26 0,5.31; IO27 0,4.04; IO32 0,9.12; IO33 0,7.85; IO34 0,11.66; IO35 0,10.39; NC 18,10.39; RX 18,12.93; SENSOR_VN 0,12.93; SENSOR_VP 0,14.2; TX 18,14.2 | smd 0.9 x 3: CLK 9.635,0; CMD 8.365,0; GND2 3.285,0; IO2 14.715,0; IO13 4.555,0; IO15 13.445,0; SD0 10.905,0; SD1 12.175,0; SD2 5.825,0; SD3 7.095,0 | smd 5 x 5: GND4 8,10.5 | smd 5 x 5 bottom: GND5 8,10.5

### Placement (x,y rotation side)
3.3V  34.04,7.49 270 top
5V  24.64,7.47 270 top
C1  5.48,31.78 180 top
C2  7.6,27.02 90 top
C3  8.08,32.2 270 top
C4  7.76,29.44 0 top
C5  15.19,32.26 90 top
C6  5.73,29.21 0 top
C7A  3.42,26.88 270 top
C7B  3.42,27.13 270 top
C_3.3V  44.1,29.2 90 bottom
C_3.3V_IN  31.72,7.92 270 bottom
C_3.3V_OUT  34.32,7.23 90 bottom
C_5V_IN  22.32,7.68 270 bottom
C_5V_OUT  24.88,7.34 90 bottom
C_LED_VM  38.21,30.16 270 top
C_VS  2.2,32.9 90 top
DOWN  49.6,18.4 90 top
GND  18.8,13.7 0 top
IC9  43.61,9.18 90 top
JMP  3.1,37.5 270 top
LED_IN  30.1,20.44 0 top
MD  11.63,29.72 0 top
MOTOR  11.9,36.8 0 top
POT_20K  22.4,27.8 90 top
R1  14.45,26.2 270 top
R2  6.66,26 90 bottom
R5  18.85,27.19 270 top
R6  9.12,33.76 0 top
R7  14.1,33.69 180 top
R_BOOT  22.4,14.9 180 top
R_DOWN  48.3,18.3 90 bottom
R_EN  41.7,29.3 90 bottom
R_LED_IN  36.44,20.46 180 top
R_LED_VM  35.24,30.17 90 top
R_TX1  15.8,18.2 90 bottom
R_UP  48.6,34.2 270 bottom
RGB_LED  29.28,29.54 180 top
U0_RX  18.8,21.5 0 top
U0_TX  18.8,24.1 0 top
U1_RX  18.8,16.2 0 top
U1_TX  18.8,18.9 0 top
U$1  2.8,12.4 0 top
U$2  38,13.5 0 bottom
UP  49.5,34.2 90 top

### Tracks (layer width: path | path; a pad name or v marks a point on that pad's centre or on a via)
3.3V  (via drill 0.35)
  Top 0.2: R_BOOT.1 32.8,14.9 34.04,13.66 34.04,10.54
  Top 0.305: 34.04,10.54 3.3V.2
  Top 0.406: R_LED_IN.1 40.36,20.46 v40.5,20.6
  Bottom 0.152: C_3.3V_OUT.2 34.08,8.62 | v34.6,9.1 34.6,9 34.3,8.7 v34.65,8.35 34.38,8.62 C_3.3V_OUT.2 | C_3.3V_OUT.2 33.82,8.62 v33.6,8.4
  Bottom 0.305: U$2.3V3 38.9,30.24 | C_3.3V.2 v44.12,30.2 v44.12,30.19
  Bottom 0.406: 44.05,30.25 C_3.3V.2
  Bottom 0.61: U$2.3V3 v41.69,30.24 R_EN.2 44.05,30.25
  other vias: 33.6,9.1
  pour Top (rank 5, no thermals): 33.3,11.5 33.3,8.2 33.4,8.1 34.9,8.1 34.9,11.5 34.8,11.6 33.4,11.6
  pour Supply: 33.3,11.9 33.3,-0.2 52.7,-0.2 52.7,39.7 36.3,39.7 36.3,11.9
5V  (via drill 0.3, 0.35)
  Top 0.152: 3.3V.3 31.8,10.53 | v31.4,9.1 31.4,9
  Top 0.2: 14.16,28.2 MD.15
  Top 0.203: C1.2 5.5,32.3 5.5,36.2 JMP.1 4.2,38.4 4.7,38.9 17.6,38.9 18.42,38.08 18.42,32.84 19.56,31.7 24.5,31.7 v24.7,31.5
  Top 0.254: MD.15 14.68,28.22 14.81,28.09 v14.81,27.43 15.12,27.12 18.27,27.12 R5.2
  Top 0.305: 26.4,29.5 26.36,29.54 RGB_LED.5
  Top 0.61: 5V.2 25.27,11.2 | 25.27,11.2 25.5,11.2 25.5,8.4 25.1,8.4 v25,8.5 | 24.3,11.1 25,11.1 25.1,11.2 25.27,11.2 | 26.87,29.5 RGB_LED.5
  Top 0.813: 24.64,9.54 5V.2 25,10.93 | v24.3,9.2 24.36,9.26 v25.05,9.26 | 24.64,9.54 24.64,8.84 v24.3,8.5 | 3.3V.3 31.74,8.74 v31.4,8.4 | 3.3V.3 31.74,8.86 v32.19,8.41 | v31.4,9.1 v32.2,9.1 | 25,10.93 25,11.1 | 25,10.93 v25,8.5 v24.3,8.5 | v31.4,9.1 v31.4,8.4 | v32.2,9.1 v32.2,8.42 v32.19,8.41 | 3.3V.3 32.1,10.95 32.1,11.1 32.2,11 v32.2,9.1 | 3.3V.3 31.74,9.44 v31.4,9.1 | v31.4,9.1 31.4,11.1 | 24.64,9.54 v24.3,9.2 | 24.3,11.1 v24.3,9.2 | v24.3,8.5 v24.3,9.2 | v31.4,8.4 v31.41,8.41 v32.19,8.41
  Supply 0.61: R_LED_VM.1 35.2,29.26 35.2,29.3
  Bottom 0.152: C_5V_OUT.2 24.53,8.73 v24.3,8.5 | C_5V_OUT.2 24.88,8.62 v25,8.5 | C_3.3V_IN.1 31.72,8.78 v31.4,9.1 | C_3.3V_IN.1 31.72,8.72 v31.4,8.4 | C_3.3V_IN.1 31.86,8.74 v32.19,8.41 | v25.05,9.26 25.05,8.86 24.88,8.86 C_5V_OUT.2
  Bottom 0.203: R2.1 7.9,26 v8.1,25.8
  other vias: 35.24,29.22 26.83,29.54
  pour Supply: 7,28.4 7,25.2 12.1,25.2 12.1,12.3 23.8,12.3 23.8,-0.2 32.9,-0.2 32.9,12.3 35.9,12.3 35.9,39.7 19.4,39.7 19.4,28.4
12V  (via drill 0.35)
  Top 0.152: MD.28 9.28,32.22 v9.2,32.3 | MD.22 13.98,32.22 v14,32.2
  Top 0.2: v2.9,28.23 3.1,28.43 3.31,28.43 C7B.1 3.6,28.53 v3.9,28.23
  Top 0.305: C7B.1 3.42,28.3 C7A.1
  Top 0.406: C6.1 4.6,29.71 v3.89,29.01
  Top 0.813: C_VS.1 3.42,30.41 3.42,28.3 | v2.9,29 2.95,29 C7B.1 v3.89,29.01 | 5V.3 22.34,8.88 v22.72,8.5 | 5V.3 21.9,10.13 v21.9,9.2 | 5V.3 22.7,10.21 v22.7,9.2 | 5V.3 21.9,11.01 21.9,11.1 21.92,11.08 v21.92,8.5 v22.72,8.5 | v22.72,8.5 22.72,11.08 22.7,11.1
  Supply 1.27: 9.9,12.5 U$1.P$2 | U$1.P$2 7.4,12.4 | U$1.P$2 9.8,14.8 | U$1.P$2 9.8,10.3
  Bottom 0.2: 3,28.1 2.9,28.2 v2.9,28.23 | v3.9,28.23 3.9,28.2
  Bottom 0.305: C_5V_IN.1 v21.92,8.5
  pour Top (rank 3, no thermals): 10.11,32.55 8.33,32.55 8.33,31.92 10.11,31.92
  pour Top (rank 4, no thermals): 13.12,31.92 13.12,32.68 15.02,32.68 15.02,31.92
  pour Supply: -0.2,39.7 -0.2,0.1 0.1,-0.2 23.4,-0.2 23.4,11.9 11.7,11.9 11.7,24.8 6.6,24.8 6.6,28.8 19,28.8 19,39.7
+5V
  Top 0.2: 8.13,27.05 C2.2
  Top 0.203: MD.8 9.96,27.05 8.13,27.05
BRA
  pour Top (rank 3, no thermals): 12.52,31.88 12.52,34.42 13.79,34.42 13.79,33.1 12.78,32.97 12.78,31.88
BRB
  Top 0.2: R6.2 10.63,33.19 MD.27
  pour Top (rank 2, no thermals): 10.52,31.92 10.52,32.94 9.5,32.94 9.5,34.46 10.65,34.46 10.65,32.94 10.77,32.81 10.77,31.92
CPI
  Top 0.2: 7.87,28.83 C4.2
  Top 0.203: C4.2 8.24,28.94 8.52,29.22 MD.5
CPO
  Top 0.203: C4.1 8.46,29.94 8.68,29.72 MD.4
DIAG  (via drill 0.35)
  Top 0.203: MD.11 11.63,24.97 v12.1,24.5
  Bottom 0.203: v12.1,24.5 12.1,23.3 12.78,22.62 U$2.IO19
DIR  (via drill 0.35)
  Top 0.2: MD.19
  Top 0.203: MD.19 17.9,30.23 v17.9,30.2
  Bottom 0.2: U$2.IO23 18.6,30.24
  Bottom 0.203: v17.9,30.2 17.9,30.24 U$2.IO23
DOWN
  Bottom 0.406: DOWN.1 49.63,17.35 R_DOWN.1 47.03,17.35 45.34,15.66 41.27,15.66 40.36,16.57 40.36,19.54 39.82,20.08 U$2.IO25
GND  (via drill 0.3, 0.35)
  Top 0.152: C_LED_VM.2 | v15.7,34.1 15.29,33.69 R7.1 15.41,33.69 v15.7,33.4 | v7.6,34.2 8.04,33.76 R6.1 7.86,33.76 v7.6,33.5 | C3.2 7.58,32.8 v7.6,32.8
  Top 0.203: v29.5,25.7 28.95,25.15 v29.5,24.6 29.38,24.48 29.38,23.62 29.85,24.1 29.9,24.1 | 31.5,26.1 31.7,26.3 | 28.3,23.5 v28.3,24.6 | 30.3,24.1 30.2,24.1 | 30.45,25.55 v30.6,25.7 | 31.9,25.7 v31.8,25.7 | 29.95,24.05 U$2.GND4 30.1,24 | 29.95,24.05 29.9,24.1 | v29.5,23.45 29.07,23.88 28.9,24.05 29.95,24.05 | 29.9,24.1 28.1,22.3 v29.5,22.3 v28.3,22.3 27.8,22.3 | v30.6,22.3 30.2,22.3 29.5,23 | 31.7,23.4 v31.8,23.4 | 30.2,23.4 v30.6,23.4 | 30.2,24.1 30.2,23.4 | 30.2,24.1 30.1,24 | 29.7,23.2 29.7,23.6 30.1,24 | 29.43,22.38 29.4,22.4 | 30.6,22.4 30.2,22.8 30.2,23.4 | C7B.2 2.95,26.2 v2.9,26.2 | C7A.2 3.63,25.93 v3.9,26.2 | C7B.2 3.47,25.73 v3.9,25.3 | C7B.2 2.98,25.3 v2.9,25.3
  Top 0.254: MD.3 10.61,30.22 10.62,30.23
  Top 0.305: U$2.GND4 30,23.5 29.5,23 | U$2.GND4 29.88,23.88 29.07,23.88 | U$2.GND4 29.5,23.5 28.3,23.5 | U$2.GND4 29.1,23.1
  Top 0.813: 3.3V.1 36.34,10.64
  GND 1.27: IC9.2 43.61,5.49 43.6,5.5 IC9.2 | IC9.2 43.61,1.12 43.6,1.11 IC9.2 | IC9.2 45.82,3.18 v47.1,1.9 | IC9.2 41.72,3.18 41.7,3.2 41.75,3.25 43.54,3.25 IC9.2 | IC9.2 42.38,3.18 41.7,2.5 42.93,2.5 IC9.2 | IC9.2 42.03,1.6 41.9,1.6 43.48,3.18 IC9.2 | IC9.2 42.8,2.37 42.8,1.3 | IC9.2 43.61,3.31 45,4.7 44.5,5.2 42.9,5.2 41.9,4.2 41.9,4 43.7,4 43.7,1.71 44.3,1.11 44.3,2.49 IC9.2
  Bottom 0.152: 15.8,32.37 15.8,32.4
  Bottom 0.203: v28.3,25.7 28.15,25.85 28.25,25.85 | v29.5,25.7 29.35,25.85 28.25,25.85 | 30.1,24.05 v29.5,23.45 32.25,23.45 | 30.1,24.05 30.15,24.05 30.1,24.1 30,24.1 | 30.1,24.05 29.6,24.05 29.32,24.32 29.32,24.48 29.38,24.52 29.32,24.57 29.32,24.6 v29.5,24.6 28.25,25.85 | 30.3,25.4 v30.6,25.7 | 30.8,26.1 30.1,26.1 | 30.25,23.4 30.25,24.05 30.2,24 | 30.2,24 U$2.GND4 | U$2.GND4 30,24.1 | 30,24.1 29.9,24.1 28.1,22.3 v29.5,22.3 | v31.8,25.7 v31.8,24.6 31.1,23.9 | 29.75,23.65 30.1,24 U$2.GND4 | 29.75,23.65 29.6,23.65 | 32.2,23.8 v31.8,23.4 30.9,23.4 | 29.6,22.3 29.7,22.4 29.7,23.6 | 29.75,23.65 29.7,23.6 | 30.2,24 30.2,23.4 v30.6,23.4 | 30.2,24 29.4,23.2 29.4,22.4 28,22.4 | 29.7,23.6 29.6,23.5
  Bottom 0.305: U$2.GND4 30,25.3 30.8,26.1
  Bottom 1.27: IC9.2 43.61,1.12 43.6,1.11 IC9.2 | IC9.2 43.61,5.49 43.6,5.5 | IC9.2 43.59,3.2 41.7,3.2 | IC9.2 42.3,4.49 42.3,4.7 | IC9.2 43.61,3.31 45,4.7 | IC9.2 42.03,1.6 41.9,1.6 | IC9.2 45,1.8 | IC9.2 43.61,2.11 42.8,1.3 42.8,2.37 IC9.2 | IC9.2 43.61,2.09 44.3,1.4 | IC9.2 44.62,3.18 45.4,2.4 44.39,2.4 IC9.2 | IC9.2 44.58,3.18 45.4,4 44.43,4 44.45,4.02 44.45,5.05 44.4,5.1 43.61,4.31 IC9.2 | IC9.2 43.61,4.39 42.8,5.2 | IC9.2 42.72,3.18 41.8,4.1 | IC9.2 42.48,3.18 41.7,2.4
  other vias: 10.11,28.32 10.11,28.96 10.11,29.72 10.11,30.48 10.11,31.12 10.87,28.32 10.87,28.96 10.87,29.72 10.87,30.48 10.87,31.12 11.63,28.32 11.63,28.96 11.63,30.48 11.63,31.12 12.39,28.32 12.39,28.96 12.39,29.72 12.39,30.48 12.39,31.12 13.16,28.32 13.16,28.96 13.16,29.72 13.16,30.48 13.16,31.12 11.63,29.72 15.69,32.66 30.6,24.6 28.3,23.45 31.8,22.3 2.4,22.5 8.5,23.4 10.4,17.5 16.8,5.6 7.6,5.2 41.3,14.1 49.1,26.9 42.8,26 24.6,19.1 25.7,22.1 4.5,35.1 50.1,1.8
  pour Top (rank 3, no thermals): 15.19,31.88 15.19,32.9 14.43,34.42 16.08,34.42 16.08,31.88
  pour Top (rank 6, no thermals): 53.6,-1.1 53.6,40.74 -1.32,40.74 -1.32,-1.1
  pour GND: -0.92,-0.8 -0.92,40.44 53.3,40.44 53.3,-0.8
  pour Bottom: 53,-0.5 53,40.04 -0.52,40.04 -0.52,-0.5
  pour Top (rank 4): 7.3,31.9 7.8,31.9 7.8,32.6 8.2,33 8.7,33 8.8,33.1 8.8,34.4 8.7,34.5 7.4,34.5 7.3,34.4
  pour Top (rank 4, no thermals): 7.92,31.88 7.92,32.9 8.81,32.9 8.81,34.55 7.28,34.55 7.28,31.88
INDEX  (via drill 0.35)
  Top 0.203: MD.12 12.13,25.97 v12.4,25.7
  Bottom 0.152: U$2.IO21 19.96,25.2
  Bottom 0.203: v12.4,25.7 12.9,25.2 19.96,25.2
LED_IN  (via drill 0.35)
  Top 0.305: v34,22.9 33.8,23.1 33.8,29.1 33.36,29.54 RGB_LED.2
  Bottom 0.305: U$2.IO32 34.38,22.62 34.1,22.9 v34,22.9
M_ENABLE  (via drill 0.35)
  Top 0.203: MD.2 6.92,30.72 v6.6,30.4
  Bottom 0.203: U$2.IO4 9.13,16.27 8.5,16.9 8.5,21.3 5.9,23.9 5.9,25.5 5.9,25.73 | 5.9,25.73 5.9,26 | 5.9,26 5.9,26.5 5.9,30 6.3,30.4 v6.6,30.4 | 5.9,26 R2.2 5.9,25.73 | 5.9,25.73 5.9,26
  Bottom 0.305: 19.97,16.3 U$2.IO4
MS1  (via drill 0.35)
  Top 0.203: MD.9 10.61,27.2 10.61,26.03 10.39,25.81 v10.39,25.7
  Bottom 0.2: 20.02,20.1 U$2.IO5
  Bottom 0.203: v10.39,25.7 9.92,25.23 9.92,21.66 11.48,20.1 20.02,20.1
MS2  (via drill 0.35)
  Top 0.203: MD.10 11.13,25.03 v10.6,24.5
  Bottom 0.203: v10.6,24.5 10.6,22.5 11.75,21.35 U$2.IO18
N$1
  Top 1.27: U$1.P$1 2.8,5.2 6.29,1.71 39.01,1.71 40.2,2.9 40.2,7.6 41.78,9.18 IC9.1
N$2
  Top 0.406: LED_IN.A 35.47,20.44 R_LED_IN.2
  Top 0.813: 31.17,20.46 LED_IN.A
N$3  (via drill 0.35)
  Top 0.2: v20.32,14.95 20.38,14.9 R_BOOT.2
  Bottom 0.2: v20.32,14.95 20,14.95 U$2.IO0
N$4  (via drill 0.35)
  Top 0.203: v4.8,27.4 5.2,27.8 8.3,27.8 8.72,28.22 MD.7
  Top 0.305: JMP.2 3.1,36.7 v2.7,36.3
  Bottom 0.305: v2.7,36.3 1.3,36.3 1,36 1,27.6 1.5,27.1 4.5,27.1 v4.8,27.4
N$6  (via drill 0.35)
  other vias: 16.6,26.2
N$7  (via drill 0.35)
  other vias: 15.5,24
N$10
  Bottom 0.406: U$2.EN 40.28,28.97 40.9,28.35 R_EN.1
N$14  (via drill 0.35)
  other vias: 26.2,26.7
N$22  (via drill 0.35)
  other vias: 45.3,38.4
N$23  (via drill 0.35)
  other vias: 45.3,22.4
N$25  (via drill 0.35)
  other vias: 17.8,33.2
N$77
  Top 0.305: 35,31.14 RGB_LED.3 31.75,31.12 R_LED_VM.2
  Top 0.406: 35,31.14 38.19,31.14 C_LED_VM.1
OA1
  pour Top (rank 2, no thermals): 12.27,31.88 12.27,34.29 12.78,34.8 14.45,34.8 14.45,38.54 12.27,38.54 12.27,35.56 11.76,35.05 11.76,31.88
OA2
  pour Top (rank 5, no thermals): 13.79,31.62 16.33,31.62 16.33,34.8 14.81,34.8 14.81,38.54 17.22,38.54 17.22,31.12 13.79,31.12
OB1
  pour Top (no thermals): 10.96,31.88 11.4,31.88 11.4,35.14 11.95,35.69 11.95,38.54 9.39,38.54 9.39,34.19 10.96,33.09
OB2
  pour Top (rank 5, no thermals): 9.5,31.1 6.3,31.1 6.2,31.2 6.2,38.5 9.1,38.5 9.1,35.1 9.1,35 9.1,34.8 7,34.8 7,31.7 7.1,31.6 9.5,31.6
PDN_UART  (via drill 0.35)
  Top 0.2: MD.14 13.15,27.24 13.15,26.99 13.16,26.99
  Top 0.203: 13.16,26.99 13.16,26.79 13.74,26.2 R1.2 | U1_RX.TP 15.3,16.2 v14.1,17.4
  Top 0.254: R1.2 13.95,17.55 v14.1,17.4
  Bottom 0.203: 16.1,17.54 16.09,17.54 15.88,17.32 | 15.88,17.32 R_TX1.1 | 15.8,17.4 15.88,17.32
  Bottom 0.254: U$2.IO16 16.1,17.54 | v14.1,17.4 15.8,17.4
STEP  (via drill 0.35)
  Top 0.203: MD.16 15.74,28.72 15.76,28.74 17.16,28.74 v17.4,28.5
  Bottom 0.203: U$2.IO22 19.97,29 17.9,29 v17.4,28.5
  Bottom 0.305: 20.41,28.86 20.11,28.86 U$2.IO22
UART0_RX  (via drill 0.35)
  Top 0.203: U0_RX.TP 22.8,21.5 v22.9,21.6
  Bottom 0.203: v22.9,21.6 22.1,22.4 22.1,26.2 21.87,26.43 U$2.RX
UART0_TX  (via drill 0.35)
  Top 0.203: U0_TX.TP 22.6,24.1 v22.9,24.4
  Bottom 0.203: v22.9,24.4 22.9,27.2 22.4,27.7 U$2.TX
UART1_TX  (via drill 0.35)
  Top 0.203: U1_TX.TP 16.05,18.9 R_TX1.2
  Bottom 0.254: U$2.IO17 16.14,18.81 R_TX1.2
  other vias: 15.8,19.15
UP
  Bottom 0.406: U$2.IO33 40.95,21.35 42.9,23.3 44.4,23.3 46.5,25.4 46.5,34.5 47.2,35.2 48.55,35.2 R_UP.1 49.43,35.15 UP.2
VCP
  Top 0.2: C6.2 5.73,28.6 5.73,28.59
  Top 0.203: MD.6 8.65,28.72 8.13,28.2 6.7,28.2 6.3,28.6 5.73,28.6
VREF
  Top 0.2: MD.17
  Top 0.203: POT_20K.2 21.62,29.22 MD.17
VREF1
  Top 0.254: R5.1 19.86,27.7 23.2,27.7 23.8,27.1 POT_20K.3

### Text on the board
tNames: MaD | v2.3
bNames: MaD | v2.3